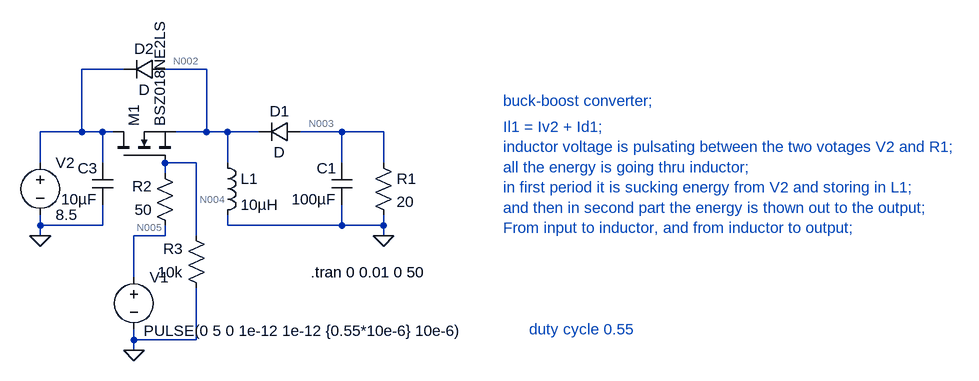
[diagram p0: schematic lecture_6_buck_boost.asc]
lecture_6_buck_boost.asc, the LTspice schematic file:
Version 4
SHEET 1 1192 680
WIRE -160 -16 -224 -16
WIRE -32 -16 -96 -16
WIRE -224 80 -224 -16
WIRE -224 80 -288 80
WIRE -192 80 -224 80
WIRE -176 80 -192 80
WIRE -32 80 -32 -16
WIRE -32 80 -80 80
WIRE 0 80 -32 80
WIRE 48 80 0 80
WIRE 176 80 112 80
WIRE 240 80 176 80
WIRE -288 128 -288 80
WIRE -192 128 -192 80
WIRE -48 128 -96 128
WIRE 0 128 0 80
WIRE 176 128 176 80
WIRE 240 128 240 80
WIRE -96 144 -96 128
WIRE -288 224 -288 208
WIRE -192 224 -192 192
WIRE -192 224 -288 224
WIRE 0 224 0 208
WIRE 176 224 176 192
WIRE 176 224 0 224
WIRE 240 224 240 208
WIRE 240 224 176 224
WIRE -288 240 -288 224
WIRE -96 240 -96 224
WIRE -96 240 -144 240
WIRE -48 240 -48 128
WIRE 240 240 240 224
WIRE -144 304 -144 240
WIRE -144 400 -144 384
WIRE -48 400 -48 320
WIRE -48 400 -144 400
WIRE -144 416 -144 400
FLAG -288 240 0
FLAG 240 240 0
FLAG -144 416 0
SYMBOL voltage -144 288 R0
WINDOW 3 15 98 Left 2
WINDOW 123 24 124 Left 2
WINDOW 39 0 0 Left 0
SYMATTR Value PULSE(0 5 0 1e-12 1e-12 {0.55*10e-6} 10e-6)
SYMATTR InstName V1
SYMBOL ind -16 112 R0
SYMATTR InstName L1
SYMATTR Value 10µH
SYMBOL res 224 112 R0
SYMATTR InstName R1
SYMATTR Value 20
SYMBOL nmos -176 128 R270
SYMATTR InstName M1
SYMATTR Value BSZ018NE2LS
SYMBOL res -80 240 R180
WINDOW 0 36 76 Left 2
WINDOW 3 36 40 Left 2
SYMATTR InstName R2
SYMATTR Value 50
SYMBOL res -32 336 R180
WINDOW 0 36 76 Left 2
WINDOW 3 36 40 Left 2
SYMATTR InstName R3
SYMATTR Value 10k
SYMBOL voltage -288 112 R0
WINDOW 123 0 0 Left 0
WINDOW 39 0 0 Left 0
SYMATTR InstName V2
SYMATTR Value 8.5
SYMBOL diode 112 64 R90
WINDOW 0 0 32 VBottom 2
WINDOW 3 32 32 VTop 2
SYMATTR InstName D1
SYMBOL cap -176 192 R180
WINDOW 0 24 56 Left 2
WINDOW 3 24 8 Left 2
SYMATTR InstName C3
SYMATTR Value 10µF
SYMBOL cap 192 192 R180
WINDOW 0 24 56 Left 2
WINDOW 3 24 8 Left 2
SYMATTR InstName C1
SYMATTR Value 100µF
SYMBOL diode -96 -32 R90
WINDOW 0 0 32 VBottom 2
WINDOW 3 32 32 VTop 2
SYMATTR InstName D2
TEXT 128 296 Left 2 !.tran 0 0.01 0 50
TEXT 424 32 Left 2 ;buck-boost converter;
TEXT 424 72 Left 2 ;Il1 = Iv2 + Id1;\ninductor voltage is pulsating between the two votages V2 and R1;\nall the energy is going thru inductor;\nin first period it is sucking energy from V2 and storing in L1;\nand then in second part the energy is thown out to the output;\nFrom input to inductor, and from inductor to output;
TEXT 464 384 Left 2 ;duty cycle 0.55

The netlist it stands for:
* lecture_6_buck_boost.asc
V1 N005 0 PULSE(0 5 0 1e-12 1e-12 {0.55*10e-6} 10e-6)
L1 N002 0 10µH
R1 N003 0 20
M1 N001 N004 N002 N002 BSZ018NE2LS
R2 N005 N004 50
R3 0 N004 10k
V2 N001 0 8.5
D1 N003 N002 D
C3 0 N001 10µF
C1 0 N003 100µF
D2 N002 N001 D
.model D D
.lib standard.dio
.model NMOS NMOS
.model PMOS PMOS
.lib standard.mos
.tran 0 0.01 0 50
* buck-boost converter;
* Il1 = Iv2 + Id1;
* inductor voltage is pulsating between the two votages V2 and R1;
* all the energy is going thru inductor;
* in first period it is sucking energy from V2 and storing in L1;
* and then in second part the energy is thown out to the output;
* From input to inductor, and from inductor to output;
* duty cycle 0.55
.backanno
.end

* Results of the author's LTspice run, read from the files saved beside the schematic
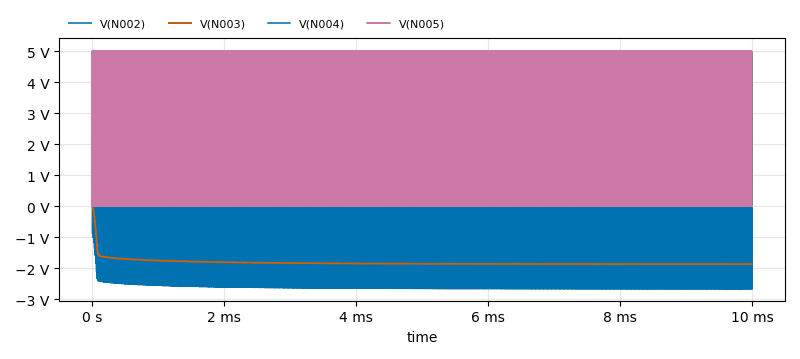
[diagram p1: Transient Analysis of lecture_6_buck_boost.asc, plotted from the saved traces]
* Transient Analysis, 1 run:
*   V(N002): min -2.66 V, max 2.878 V, average 96.66 mV, rms 2.451 V, last -2.656 V
*   V(N003): min -1.868 V, max 0 V, average -1.819 V, rms 1.824 V, last -1.868 V
*   V(N004): min -8.468 mV, max 5.113 V, average 2.736 V, rms 3.686 V, last 103.9 µV
*   V(N005): min 0 V, max 5 V, average 2.75 V, rms 3.708 V, last 0 V